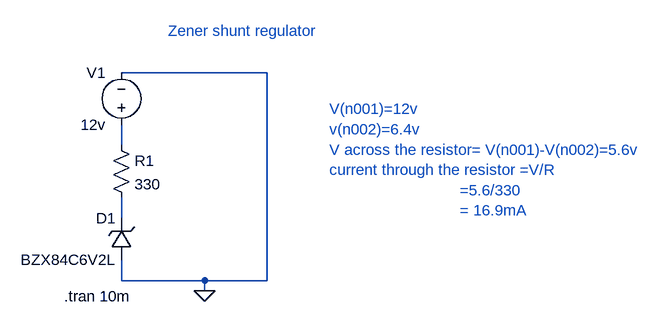
[diagram p0: schematic Zener shunt regulator.asc]
Zener shunt regulator.asc, the LTspice schematic file:
Version 4.1
SHEET 1 880 680
WIRE 208 -32 -16 -32
WIRE -16 80 -16 48
WIRE -16 192 -16 160
WIRE -16 288 -16 256
WIRE 112 288 -16 288
WIRE 208 288 208 -32
WIRE 208 288 112 288
WIRE 112 304 112 288
FLAG 112 304 0
SYMBOL voltage -16 64 R180
WINDOW 0 24 96 Left 2
WINDOW 3 24 16 Left 2
WINDOW 123 0 0 Left 0
WINDOW 39 0 0 Left 0
SYMATTR InstName V1
SYMATTR Value 12v
SYMBOL res -32 64 R0
SYMATTR InstName R1
SYMATTR Value 330
SYMBOL zener 0 256 R180
WINDOW 0 24 64 Left 2
WINDOW 3 24 0 Left 2
SYMATTR InstName D1
SYMATTR Value BZX84C6V2L
SYMATTR Description Diode
SYMATTR Type diode
TEXT -104 312 Left 2 !.tran 10m
TEXT 56 -96 Left 2 ;Zener shunt regulator
TEXT 304 24 Left 2 ;V(n001)=12v\nv(n002)=6.4v\nV across the resistor= V(n001)-V(n002)=5.6v\ncurrent through the resistor =V/R\n                             =5.6/330\n                             = 16.9mA

The netlist it stands for:
* Zener shunt regulator.asc
V1 N001 0 12v
R1 N001 N002 330
D1 0 N002 BZX84C6V2L
.model D D
.lib standard.dio
.tran 10m
* Zener shunt regulator
* V(n001)=12v
* v(n002)=6.4v
* V across the resistor= V(n001)-V(n002)=5.6v
* current through the resistor =V/R
*                              =5.6/330
*                              = 16.9mA
.backanno
.end